# EasyEDA Pro project ProPrj_CH634X-PD-R0-1v1_2025-08-08(1).epro, board PCB6
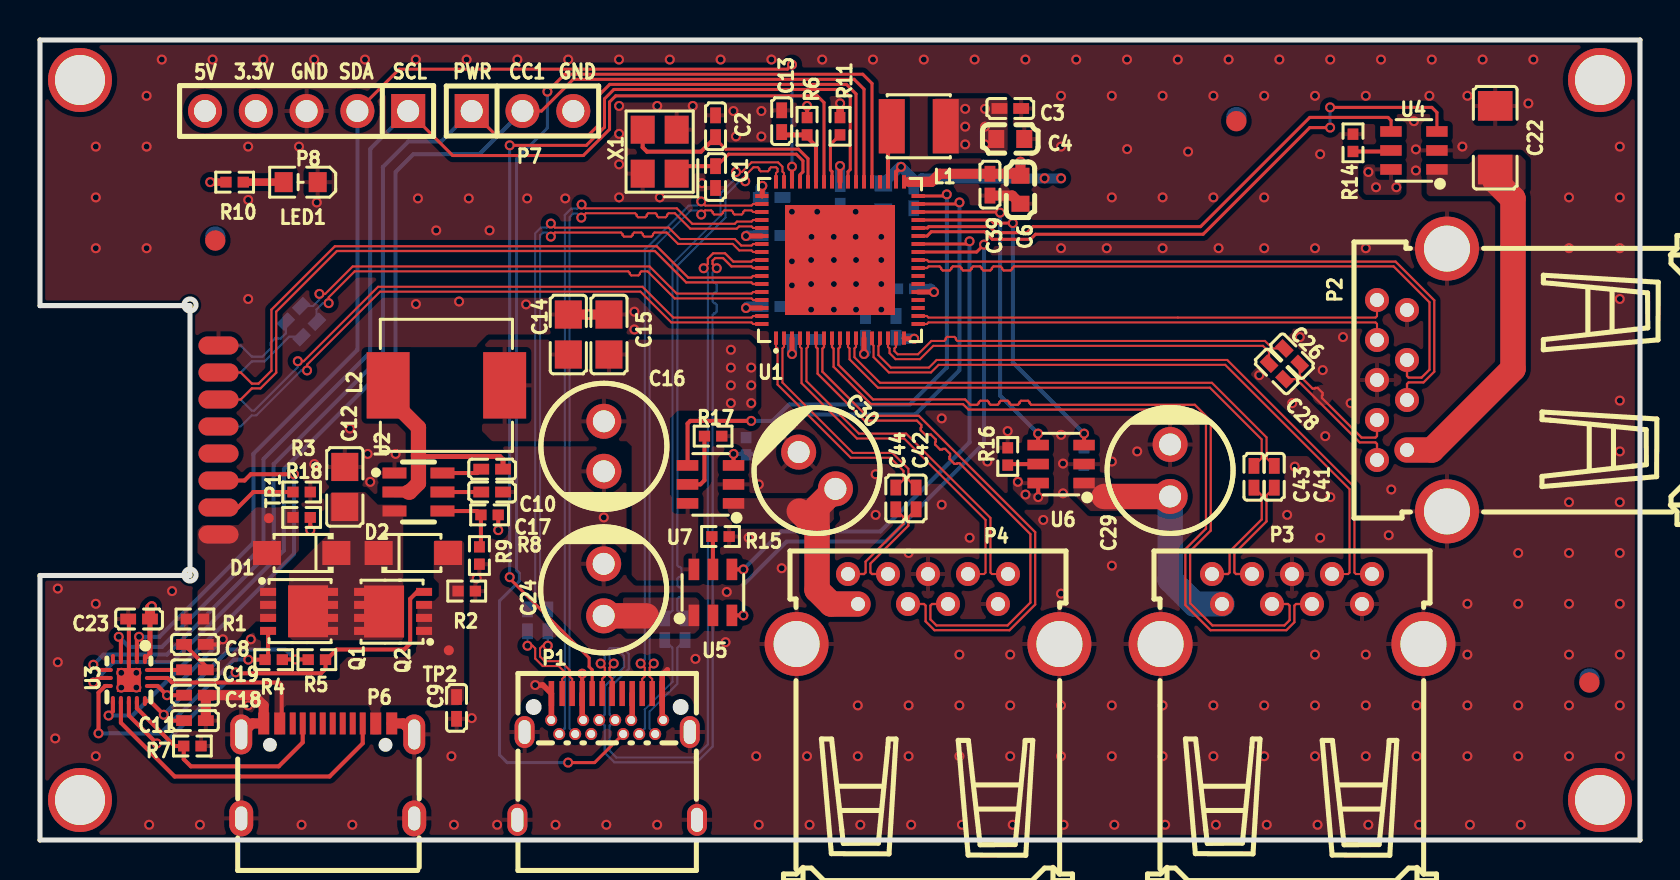
[diagram p1: board, top side]
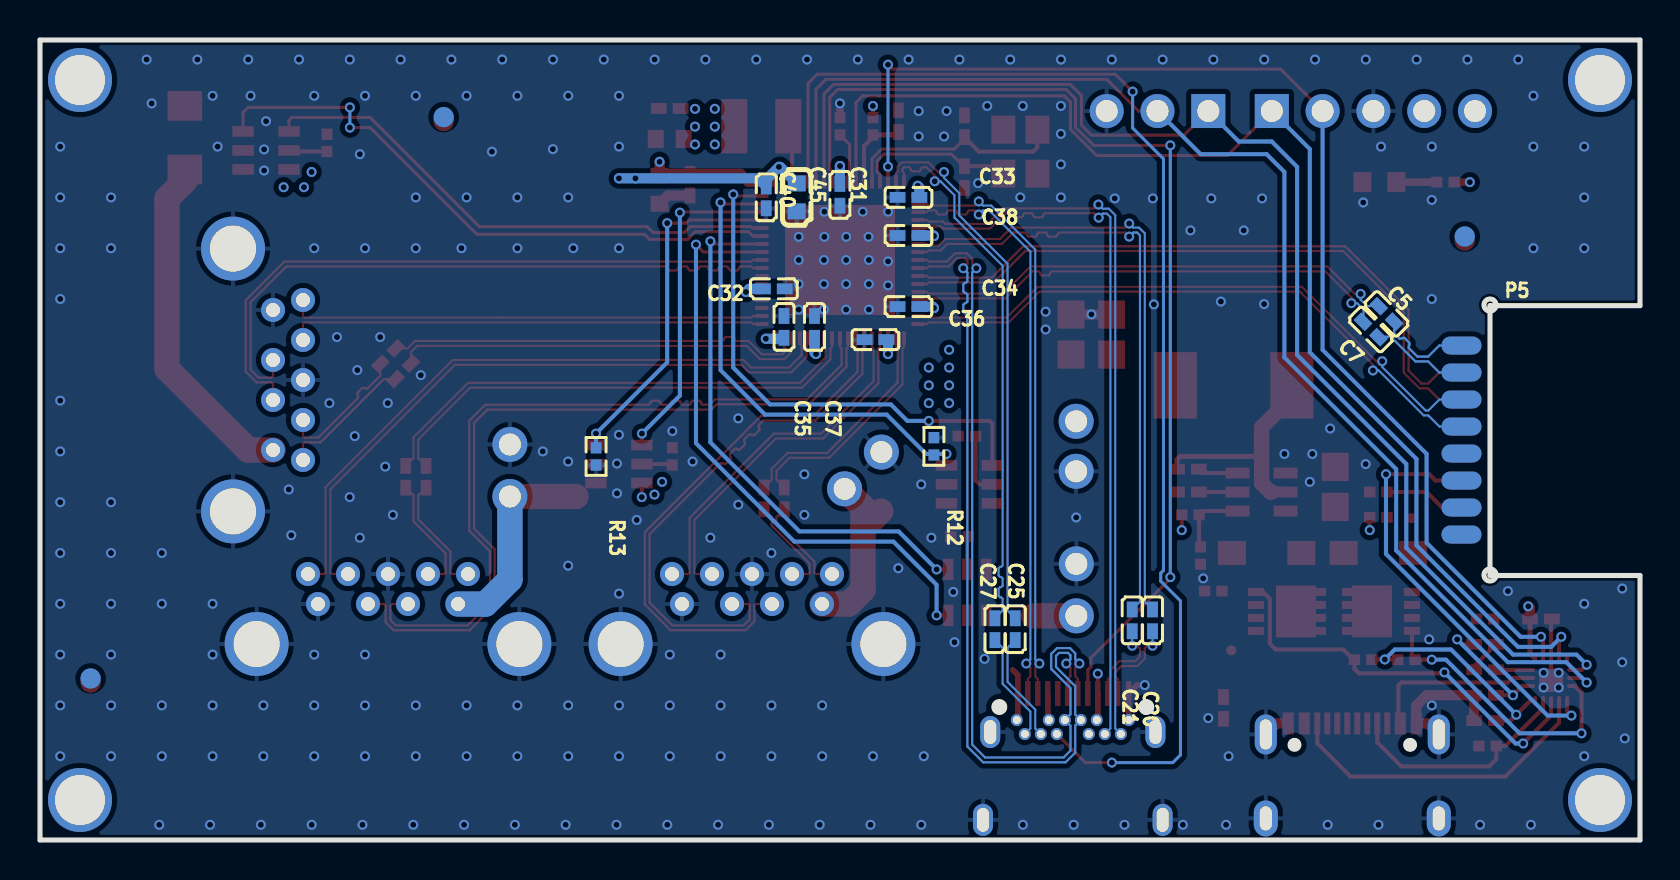
[diagram p2: board, bottom side, seen from below]

Outline 80 x 40 mm; copper layers: Top Layer, Layer 1, Layer 2, Bottom Layer. Coordinates in mm from the lower left corner of the outline.
Outline path: circle c7.5,26.75 r0.3 ; circle c7.5,13.25 r0.3 ; 0,40 80,40 80,0 0,0 0,13.22 7.5,13.22 7.5,26.72 0,26.72 0,40
Stack: Top Layer 0.035mm / Dielectric1 1.51mm FR4 er 4.5 / Layer 1 0.035mm / Dielectric2 0.48mm PP er 4.5 / Layer 2 0.035mm / Dielectric3 0.48mm PP er 4.5 / Bottom Layer 0.035mm

## Design rules (mm)
net UP_HS_DP: DP1
net UP_HS_DM: DP1
net UP_SS_RXA: UP_SS_RX
net UP_SS_RXB: UP_SS_RX
net UP_SS_TXA: UP_SS_TX
net UP_SS_TXB: UP_SS_TX
net P4_SS_TXB: P4_SS_TX
net P4_SS_TXA: P4_SS_TX
net P4_HS_DM: P4_HS_D
net P1_HS_DM: P1_HS_D
net P4_HS_DP: P4_HS_D
net P1_HS_DP: P1_HS_D
net P1_SS_TXB: P1_SS_TX
net P4_SS_RXB: P4_SS_RX
net P1_SS_TXA: P1_SS_TX
net P4_SS_RXA: P4_SS_RX
net P1_SS_RXB: P1_SS_RX
net P1_SS_RXA: P1_SS_RX
net P3_HS_DP: P3_HS_D
net P3_HS_DM: P3_HS_D
net P3_SS_TXB: P3_SS_TX
net P3_SS_TXA: P3_SS_TX
net P3_SS_RXB: P3_SS_RX
net P3_SS_RXA: P3_SS_RX
net P2_SS_TXB: P2_SS_TX
net P2_SS_TXA: P2_SS_TX
net P2_HS_DM: P2_HS_D
net P2_SS_RXB: P2_SS_RX
net P2_HS_DP: P2_HS_D
net P2_SS_RXA: P2_SS_RX
net $1N152: UP_HS_D
net $1N151: UP_HS_D
net $1N61: DP5
net $1N60: DP5
net $1N65: DP6
net $1N1819: DP2
net $1N64: DP6
net $1N1820: DP2
net $1N1769: DP4
net $1N1773: DP3
net $1N1770: DP4
net $1N1774: DP3
net P1C_SS_TXB: DP8
net P1C_SS_TXA: DP8
net P1C_SS_RXB: DP7
net P1C_SS_RXA: DP7
template: 自定义配置
spacing copperThickness1oz (default): track to track 0.102, other pairs 0.025 to 0.3
spacing copperThickness2oz: track to track 0.203, other pairs 0.152 to 0.3
track width copperThickness1oz (default): min 0.127, default 0.203, max 2.54
track width copperThickness2oz: min 0.203, default 0.254, max 2.54
differential pair differentialPair (default): width min 0.127, default 0.254, max 2.54; gap min 0.152, default 0.152
differential pair DIFF90: width min 0.112, default 0.112, max 0.112; gap min 0.127, default 0.127
differential pair DIFF100: width min 0.104, default 0.104, max 0.104; gap min 0.14, default 0.14
via viaSize (default): diameter min 0.5, default 0.5, max 10; hole min 0.3, default 0.3, max 6.299
net UP_HS_DP uses DIFF90
net UP_HS_DM uses DIFF90
net UP_SS_RXA uses DIFF100
net UP_SS_RXB uses DIFF100
net UP_SS_TXA uses DIFF100
net UP_SS_TXB uses DIFF100
net P4_SS_TXB uses DIFF100
net P4_SS_TXA uses DIFF100
net P4_HS_DM uses DIFF90
net P1_HS_DM uses DIFF90
net P4_HS_DP uses DIFF90
net P1_HS_DP uses DIFF90
net P1_SS_TXB uses DIFF100
net P4_SS_RXB uses DIFF100
net P1_SS_TXA uses DIFF100
net P4_SS_RXA uses DIFF100
net P1_SS_RXB uses DIFF100
net P1_SS_RXA uses DIFF100
net P3_HS_DP uses DIFF90
net P3_HS_DM uses DIFF90
net P3_SS_TXB uses DIFF100
net P3_SS_TXA uses DIFF100
net P3_SS_RXB uses DIFF100
net P3_SS_RXA uses DIFF100
net P2_SS_TXB uses DIFF100
net P2_SS_TXA uses DIFF100
net P2_HS_DM uses DIFF90
net P2_SS_RXB uses DIFF100
net P2_HS_DP uses DIFF90
net P2_SS_RXA uses DIFF100
net $1N152 uses DIFF90
net $1N151 uses DIFF90
net $1N61 uses DIFF100
net $1N60 uses DIFF100
net $1N65 uses DIFF100
net $1N1819 uses DIFF90
net $1N64 uses DIFF100
net $1N1820 uses DIFF90
net $1N1769 uses DIFF90
net $1N1773 uses DIFF90
net $1N1770 uses DIFF90
net $1N1774 uses DIFF90
net P1C_SS_TXB uses DIFF100
net P1C_SS_TXA uses DIFF100
net P1C_SS_RXB uses DIFF100
net P1C_SS_RXA uses DIFF100
diff pair DP1 uses DIFF90
diff pair UP_SS_RX uses DIFF100
diff pair UP_SS_TX uses DIFF100
diff pair P4_SS_TX uses DIFF100
diff pair P4_HS_D uses DIFF90
diff pair P1_HS_D uses DIFF90
diff pair P1_SS_TX uses DIFF100
diff pair P4_SS_RX uses DIFF100
diff pair P1_SS_RX uses DIFF100
diff pair P3_HS_D uses DIFF90
diff pair P3_SS_TX uses DIFF100
diff pair P3_SS_RX uses DIFF100
diff pair P2_SS_TX uses DIFF100
diff pair P2_HS_D uses DIFF90
diff pair P2_SS_RX uses DIFF100
diff pair UP_HS_D uses DIFF90
diff pair DP5 uses DIFF100
diff pair DP6 uses DIFF100
diff pair DP2 uses DIFF90
diff pair DP4 uses DIFF90
diff pair DP3 uses DIFF90
diff pair DP8 uses DIFF100
diff pair DP7 uses DIFF100
pour e418 uses copperRegion1
pour e672 uses copperRegion1
pour e734 uses copperRegion1
pour e3995 uses copperRegion1
pour e4331 uses copperRegion1
pour e4785 uses copperRegion1
pour e4806 uses copperRegion1
pour e16219 uses copperRegion1
pour e16602 uses copperRegion1

## Placement (name value [footprint] x y rotation side)
C1  20pF  [C0402]  33.78 33.15 270 top
C2  20pF  [C0402]  33.78 35.69 270 top
C3  1uF  [C0402]  48.51 36.58 180 top
C4  10uF  [C0603]  48.51 35.05 0 top
C5  100nF  [C0402]  12.67 26.3 225 bottom
C6  10uF  [C0603]  49.02 32.51 270 top
C7  100nF  [C0402]  13.46 25.53 225 bottom
C8  1uF  [C0402]  7.75 9.78 0 top
C9  1uF  [C0402]  20.83 6.6 90 top
C10  100nF  [C0402]  22.61 18.54 180 top
C11  100nF  [C0402]  7.75 5.97 180 top
C12  22uF  [C0805]  15.24 17.65 270 top
C13  100nF  [C0402]  37.08 35.94 270 top
C14  22uF  [C0805]  26.42 25.27 270 top
C15  22uF  [C0805]  28.45 25.27 270 top
C16  220uF  [CAP-TH_BD6.3-P2.50-D0.6-FD-1]  28.19 19.68 270 top
C17  1uF  [C0402]  22.61 17.4 180 top
C18  1uF  [C0402]  7.75 7.24 0 top
C19  1uF  [C0402]  7.75 8.51 0 top
C20  100nF  [C0402]  24.37 10.98 270 bottom
C21  100nF  [C0402]  25.39 10.98 270 bottom
C22  47uF  [C1206]  72.76 35.11 90 top
C23  1uF  [C0402]  4.95 11.05 180 top
C24  100uF  [CAP-TH_BD6.3-P2.60-D0.6-FD-1]  28.18 12.51 90 top
C25  100nF  [C0402]  31.24 10.54 90 bottom
C26  100nF  [C0402]  62.6 24.19 135 top
C27  100nF  [C0402]  32.25 10.54 90 bottom
C28  100nF  [C0402]  61.84 23.43 135 top
C29  100uF  [CAP-TH_BD6.3-P2.60-D0.6-FD-1]  56.51 18.48 90 top
C30  100uF  [CAP-TH_BD6.3-P2.60-D0.6-FD-1]  38.85 18.48 135 top
C31  100nF  [C0402]  40.01 32.26 90 bottom
C32  100nF  [C0402]  43.31 27.56 0 bottom
C33  100nF  [C0402]  36.58 32.13 180 bottom
C34  100nF  [C0402]  36.58 26.67 180 bottom
C35  100nF  [C0402]  42.8 25.65 270 bottom
C36  100nF  [C0402]  38.23 25.02 180 bottom
C37  100nF  [C0402]  41.27 25.65 270 bottom
C38  100nF  [C0402]  36.58 30.23 180 bottom
C39  1uF  [C0402]  47.5 32.77 270 top
C40  1uF  [C0402]  43.69 32.13 90 bottom
C41  100nF  [C0402]  61.71 18.16 90 top
C42  100nF  [C0402]  43.8 17.08 90 top
C43  100nF  [C0402]  60.7 18.16 90 top
C44  100nF  [C0402]  42.79 17.08 90 top
C45  10uF  [C0603]  42.16 32.13 270 bottom
D1  DSS34  [SOD-123FL_L2.7-W1.8-LS3.8-RD]  13.08 14.35 180 top
D2  DSS34  [SOD-123FL_L2.7-W1.8-LS3.8-RD]  18.67 14.35 0 top
L1  2.2uH  [IND-SMD_L3.0-W3.0_FNR30XXS]  43.94 35.69 180 top
L2  15uH  [IND-SMD_L7.1-W6.6]  20.32 22.73 0 top
LED1  A-SP192DGHC-C01-4T  [LED0603-FD]  13.03 32.89 0 top
NOREF  -  [Pad_e341]  78 38 0 top
NOREF#2  -  [Pad_e12903]  59.82 36.14 0 top
NOREF#3  -  [Pad_e12655]  8.76 29.97 0 top
NOREF#4  -  [Pad_e342]  78 2 0 top
NOREF#5  -  [Pad_e12905]  77.47 8.08 0 top
NOREF#6  -  [Pad_e12902]  8.76 30.18 0 top
NOREF#7  -  [Pad_e340]  2 38 0 top
NOREF#8  -  [Pad_e338]  2 2 0 top
NOREF#9  -  [Pad_e12906]  77.47 7.87 0 top
NOREF#10  -  [Pad_e12904]  59.82 35.94 0 top
P1  TYPEC-324-BCP24  [TYPE-C-SMD_TYPE-C-24P-QCHT]  28.36 4.17 0 top
P2  UEA1112C-4HK1-4H  [USB-TH_XUNPU_USB-301WD-ARY]  68.6 23 90 top
P3  UEA1112C-4HK1-4H  [USB-TH_XUNPU_USB-301WD-ARY]  62.6 11.55 0 top
P4  UEA1112C-4HK1-4H  [USB-TH_XUNPU_USB-301WD-ARY]  44.4 11.55 0 top
P5  PC  [CABLE-TYPEC1]  8.92 20 180 bottom
P6  TYPE-C 16PIN 2MD(073)  [USB-C-SMD_TYPE-C-6PIN-2MD-073]  14.39 3.45 0 top
P7  PZ254V-11-03P  [HDR-TH_3P-P2.54-V-M]  24.13 36.45 0 top
P8  PZ254V-11-05P  [HDR-TH_5P-P2.54-V-M]  13.33 36.45 180 top
Q1  SE3080G  [DFN-8_L3.1-W3.0-P0.65-LS3.3-BL]  12.95 11.43 270 top
Q2  SE3080G  [DFN-8_L3.1-W3.0-P0.65-LS3.3-BL]  17.65 11.43 90 top
R1  10kΩ  [R0402]  7.75 11.05 180 top
R2  10kΩ  [R0402]  21.34 12.45 0 top
R3  1kΩ  [R0402]  13.08 17.4 0 top
R4  680kΩ  [R0402]  11.68 9.02 0 top
R5  680kΩ  [R0402]  13.84 9.02 180 top
R6  0Ω  [R0402]  38.35 35.69 90 top
R7  5.1kΩ  [R0402]  7.62 4.7 0 top
R8  105kΩ  [R0402]  22.48 16.26 0 top
R9  20kΩ  [R0402]  21.97 14.22 90 top
R10  2kΩ  [R0402]  9.73 32.89 180 top
R11  10kΩ  [R0402]  40 35.69 90 top
R12  10kΩ  [R0402]  35.31 19.68 90 bottom
R13  10kΩ  [R0402]  52.2 19.18 270 bottom
R14  24kΩ  [R0402]  65.65 34.86 90 top
R15  24kΩ  [R0402]  34.03 15.17 0 top
R16  24kΩ  [R0402]  48.39 19.18 90 top
R17  24kΩ  [R0402]  33.65 20.19 0 top
R18  0Ω  [R0402]  13.08 16.13 0 top
TP1  -  [Test-Point-0.5mm]  11.44 16.09 0 top
TP2  -  [Test-Point-0.5mm]  20.44 9.48 0 top
U1  CH634X  [QFN-68_L8.0-W8.0-P0.40-TL-EP5.5]  40 29 90 top
U2  ETA2807FT2G  [TSOT-23-6_L2.9-W1.6-P0.95-LS2.8-BL]  18.92 17.4 270 top
U3  CH211C  [QFN16C_2X2]  4.45 8 180 top
U4  CH217K  [SOT-23-6_L2.9-W1.6-P0.95-LS2.8-BL]  68.7 34.48 90 top
U5  CH217K  [SOT-23-6_L2.9-W1.6-P0.95-LS2.8-BL]  33.64 12.38 0 top
U6  CH217K  [SOT-23-6_L2.9-W1.6-P0.95-LS2.8-BL]  51.05 18.8 90 top
U7  CH217K  [SOT-23-6_L2.9-W1.6-P0.95-LS2.8-BL]  33.53 17.78 90 top
X1  24MHz  [CRYSTAL-SMD_4P-L3.2-W2.5-BL]  30.98 34.42 90 top

## Footprints (pads in the part's own frame, mm; a bottom-side part is the same pattern mirrored in y, then rotated)
C0402
  rect 0.79x0.54 smd: 1(-0.545,0) 2(0.545,0)
C0603
  rect 0.8x0.9 smd: 1(-0.7,0) 2(0.7,0)
C0805
  rect 1.41x1.35 smd: 1(-1,0) 2(1,0)
C1206
  rect 1.485x1.728 smd: 1(-1.593,0) 2(1.593,0)
CABLE-TYPEC1
  oval 2x0.9 smd: 1(0,-4.725) 2(0,-3.375) 3(0,-2.025) 4(0,-0.675) 5(0,0.675) 6(0,2.025) 7(0,3.375) 8(0,4.725)
  oval 2x0.9 smd far side: 9(0,-4.725) 10(0,-3.375) 11(0,-2.025) 12(0,-0.675) 13(0,0.675) 14(0,2.025) 15(0,3.375) 16(0,4.725)
CAP-TH_BD6.3-P2.50-D0.6-FD-1
  round 1.75 hole 1.1: 1(-1.25,0) 2(1.25,0)
CAP-TH_BD6.3-P2.60-D0.6-FD-1
  round 1.75 hole 1.1: 1(-1.3,0) 2(1.3,0)
CRYSTAL-SMD_4P-L3.2-W2.5-BL
  rect 1.4x1.2 smd: 1(-1.1,-0.85) 2(1.1,-0.85) 3(1.1,0.85) 4(-1.1,0.85)
DFN-8_L3.1-W3.0-P0.65-LS3.3-BL
  rect 0.4x0.8 smd: 1(-0.975,-1.55) 2(-0.325,-1.55) 3(0.326,-1.55) 4(0.975,-1.55) 5(0.975,1.55) 6(0.325,1.55) 7(-0.325,1.55) 8(-0.975,1.55)
  rect 2.6x2 smd: 8(-0.004,0.45)
HDR-TH_3P-P2.54-V-M
  rect 1.7x1.7 hole 1.1: 1(-2.54,0)
  round 1.7 hole 1.1: 2(0,0) 3(2.54,0)
HDR-TH_5P-P2.54-V-M
  rect 1.7x1.7 hole 1.1: 1(-5.08,0)
  round 1.7 hole 1.1: 2(-2.54,0) 3(0,0) 4(2.54,0) 5(5.08,0)
IND-SMD_L3.0-W3.0_FNR30XXS
  rect 1.3x2.72 smd: 1(1.35,0) 2(-1.35,0)
IND-SMD_L7.1-W6.6
  rect 2.15x3.32 smd: 1(-2.913,0) 2(2.913,0)
LED0603-FD
  rect 0.9x1 smd: 1(-0.85,0) 2(0.85,0)
Pad_e338
  round 3.2 hole 2.5: 1(0,0)
Pad_e340
  round 3.2 hole 2.5: 1(0,0)
Pad_e341
  round 3.2 hole 2.5: 1(0,0)
Pad_e342
  round 3.2 hole 2.5: 1(0,0)
Pad_e12655
  round 1.016 smd: 1(0,0)
Pad_e12902
  round 1.016 smd far side: 1(0,0)
Pad_e12903
  round 1.016 smd far side: 1(0,0)
Pad_e12904
  round 1.016 smd: 1(0,0)
Pad_e12905
  round 1.016 smd far side: 1(0,0)
Pad_e12906
  round 1.016 smd: 1(0,0)
QFN16C_2X2
  rect 1.2x1.2 smd: 0(0,0)
  oval 0.2x0.5 smd: 1(-0.8,-1.05) 2(-0.4,-1.05) 4(0.4,-1.05) 5(0.8,-1.05) 9(0.8,1.05) 10(0.4,1.05) 11(0,1.05) 12(-0.4,1.05) 13(-0.8,1.05)
  oval 0.2x1 smd: 3(0,-0.8)
  oval 0.5x0.2 smd: 6(1.05,-0.5) 7(1.05,-0.1) 8(1.05,0.3) 14(-1.05,0.3) 15(-1.05,-0.1) 16(-1.05,-0.5)
QFN-68_L8.0-W8.0-P0.40-TL-EP5.5
  rect 0.665x0.2 smd: 1(-3.908,3.2) 2(-3.908,2.8) 3(-3.908,2.4) 4(-3.908,2) 5(-3.908,1.6) 6(-3.908,1.2) 7(-3.908,0.8) 8(-3.908,0.4) 9(-3.908,0) 10(-3.908,-0.4) 11(-3.908,-0.8) 12(-3.908,-1.2) 13(-3.908,-1.6) 14(-3.908,-2) 15(-3.908,-2.4) 16(-3.908,-2.8) 17(-3.908,-3.2) 35(3.908,-3.2) 36(3.908,-2.8) 37(3.908,-2.4) 38(3.908,-2) 39(3.908,-1.6) 40(3.908,-1.2) 41(3.908,-0.8) 42(3.908,-0.4) 43(3.908,0) 44(3.908,0.4) 45(3.908,0.8) 46(3.908,1.2) 47(3.908,1.6) 48(3.908,2) 49(3.908,2.4) 50(3.908,2.8) 51(3.908,3.2)
  rect 0.2x0.665 smd: 18(-3.2,-3.908) 19(-2.8,-3.908) 20(-2.4,-3.908) 21(-2,-3.908) 22(-1.6,-3.908) 23(-1.2,-3.908) 24(-0.8,-3.908) 25(-0.4,-3.908) 26(0,-3.908) 27(0.4,-3.908) 28(0.8,-3.908) 29(1.2,-3.908) 30(1.6,-3.908) 31(2,-3.908) 32(2.4,-3.908) 33(2.8,-3.908) 34(3.2,-3.908) 52(3.2,3.908) 53(2.8,3.908) 54(2.4,3.908) 55(2,3.908) 56(1.6,3.908) 57(1.2,3.908) 58(0.8,3.908) 59(0.4,3.908) 60(0,3.908) 61(-0.4,3.908) 62(-0.8,3.908) 63(-1.2,3.908) 64(-1.6,3.908) 65(-2,3.908) 66(-2.4,3.908) 67(-2.8,3.908) 68(-3.2,3.908)
  rect 5.5x5.5 smd: 69(0,0)
R0402
  rect 0.566x0.54 smd: 1(-0.433,0) 2(0.433,0)
SOD-123FL_L2.7-W1.8-LS3.8-RD
  rect 1.4x1.2 smd: 1(-1.735,0) 2(1.735,0)
SOT-23-6_L2.9-W1.6-P0.95-LS2.8-BL
  rect 0.532x1.072 smd: 1(-0.95,-1.149) 2(0,-1.149) 3(0.95,-1.149) 4(0.95,1.149) 5(0,1.149) 6(-0.95,1.149)
Test-Point-0.5mm
  round 0.5 smd: 1(0,0)
TSOT-23-6_L2.9-W1.6-P0.95-LS2.8-BL
  rect 0.55x1.2 smd: 1(-0.95,-1.2) 2(0,-1.2) 3(0.95,-1.2) 4(0.95,1.2) 5(0,1.2) 6(-0.95,1.2)
TYPE-C-SMD_TYPE-C-24P-QCHT
  oval 1x1.6 hole 0.6x1.2: 25(-4.49,-3.158) 25(-4.13,1.232) 25(4.13,1.232) 25(4.49,-3.158)
  rect 0.275x1.25 smd: A1(-2.79,3.158) A2(-2.25,3.158) A3(-1.75,3.158) A4(-1.25,3.158) A5(-0.75,3.158) A6(-0.25,3.158) A7(0.25,3.158) A8(0.75,3.158) A9(1.25,3.158) A10(1.75,3.158) A11(2.25,3.158) A12(2.75,3.158)
  round 0.6 hole 0.4: B1(2.8,1.833) B2(2.4,1.133) B3(1.601,1.133) B4(1.2,1.833) B5(0.8,1.133) B6(0.4,1.833) B7(-0.4,1.833) B8(-0.8,1.133) B9(-1.2,1.833) B10(-1.6,1.133) B11(-2.4,1.133) B12(-2.8,1.833)
USB-C-SMD_TYPE-C-6PIN-2MD-073
  rect 0.55x1.1 smd: 1(-3.2,2.375) 2(-2.4,2.375) 11(2.4,2.375) 12(3.2,2.375)
  rect 0.3x1.1 smd: 3(-1.75,2.375) 4(-1.25,2.375) 5(-0.75,2.375) 6(-0.25,2.375) 7(0.25,2.375) 8(0.75,2.375) 9(1.25,2.375) 10(1.75,2.375)
  oval 1.1x2 hole 0.6x1.5: 13(-4.325,1.825) 14(4.325,1.825)
  oval 1.2x1.8 hole 0.6x1.2: 13(-4.325,-2.375) 14(4.325,-2.375)
USB-TH_XUNPU_USB-301WD-ARY
  round 1.2 hole 0.7: 1(-3.5,0.25) 2(-1,0.25) 3(1,0.25) 4(3.5,0.25) 5(4,1.75) 6(2,1.75) 7(0,1.75) 8(-2,1.75) 9(-4,1.75)
  round 3.2 hole 2.3: 10(-6.57,-1.75) 10(6.57,-1.75)

## Nets
As in the schematic, except:
VBUS: C8.2 C18.1 D1.2 P5.9 Q1.1 Q1.2 Q1.3 R1.1 R18.1 TP1.1 U3.14
VIN: C9.2 D2.2 P6.2 P6.11 Q2.1 Q2.2 Q2.3 R2.1 TP2.1 U3.15
VHV: C12.2 D1.1 D2.1 Q1.5 Q1.6 Q1.7 Q1.8 Q2.5 Q2.6 Q2.7 Q2.8 U2.3

Pads without a net: NOREF 1; NOREF#2 1; NOREF#3 1; NOREF#4 1; NOREF#5 1; NOREF#6 1; NOREF#7 1; NOREF#8 1; NOREF#9 1; NOREF#10 1; P1 A8 B8; P5 1 2 3 4 12 13; P6 3 5 6 7 8 9; U1 20 21 23 24 38; U3 5

## Via types
v1: diameter 0.5, hole 0.299, Top Layer to Bottom Layer, 286 vias
v2: diameter 0.5, hole 0.3, Top Layer to Bottom Layer, 59 vias

## Routing (per net, layer and track width the routed paths; a pad name or vN(x,y) marks a point on that pad's centre or on a via; arc(x,y) is an arc through that point)
DVDD12: length 12.2
  Top Layer w0.254: U1.52 36.11,32.22 v2(36.11,32.71) ; U1.12 v2(41.2,24.3) ; U1.57 v2(35.3,30.2) ; U1.66 v2(35.3,26.6) ; v2(43.71,25.06) 43.23,25.06 U1.17 ; U1.22 v2(44.7,27.4) ; U1.43 v2(40,33.7) ; U1.3 v2(37.6,24.3)
  Bottom Layer w0.508: v2(43.71,25.06) 42.85,25.06 C35.2 ; C38.2 35.33,30.23 v2(35.3,30.2) ; C32.2 44.54,27.56 v2(44.7,27.4) ; v2(37.6,24.3) 37.6,24.94 C36.2 ; v2(35.3,26.6) 35.37,26.67 C34.2 ; C33.2 36.03,32.62 v2(36.11,32.71) ; v2(40,33.7) 40.01,33.69 C31.2 ; v2(41.2,24.3) 41.27,24.38 C37.2
  vias: v1(46.26,36.56) v1(46.26,35.67) v1(46.26,34.78) v1(47.25,36.56) v1(47.25,35.67) v1(47.25,34.78)
GND: length 21.4
  Top Layer w0.203: C8.1 8.29,8.69 C19.2 ; U3.3 4.45,11.01 C23.2
  Top Layer w0.28: P1.B1 31.11,6.05 P1.A12 31.11,8.25 31.37,8.51 ; 25.56,6 25.57,6.01 P1.A1 25.15,7.75 v1(24.76,7.75)
  Top Layer w0.381: v2(40.01,36.83) 40.01,36.12 R11.2
  Top Layer w0.508: P6.12 18.16,5.83 P6.14 ; C6.2 48.61,32.22 C39.2 ; C15.1 27.44,26.27 v1(27.43,26.28) 27.42,26.27 C14.1 ; P6.13 10.61,5.83 P6.1 11.19,6.72 10.67,7.24 C18.2 C11.1
  vias: v1(0.76,5.08) v1(0.89,12.57) v1(0.89,8.89) v1(2.79,34.67) v1(2.79,32.13) v1(2.79,29.59) v1(2.79,11.81) v1(2.79,4.19) v1(5.33,37.21) v1(5.33,34.67) v1(5.33,29.59) v1(5.46,0.76) v1(6.09,39.02) v1(6.6,12.45) v1(8,0.76) v1(8.63,39.02) v1(10.41,34.67) v1(10.41,32) v1(10.41,27.05) v1(10.41,6.73) v1(11.17,39.02) v1(12.95,34.67) v1(13.08,0.76) v1(13.71,39.02) v1(13.72,18.8) v1(13.84,31.88) v1(15.49,20.57) v1(15.62,0.76) v1(16.25,39.02) v1(16.38,19.3) v1(16.51,17.91) v1(17.78,19.3) v1(18.79,39.02) v1(18.8,26.8) v1(18.9,32.08) v1(19.81,30.48) v1(20.57,4.19) v1(20.7,0.76) v1(20.95,26.92) v1(21.33,39.02) v1(21.44,32.08) v1(21.59,6.09) v1(21.84,13.08) v1(22.48,30.48) v1(22.86,0.76) v1(23.87,39.02) v1(24.36,32.08) v1(24.31,26.78) v1(25.78,0.76) v1(26.26,32.08) v1(26.41,39.02) v1(28.19,16.13) v1(28.32,0.76) v1(28.95,39.02) v1(29.72,26.42) v1(29.72,25.53) v1(30.86,0.76) v1(30.99,32.13) v1(31.49,39.02) v1(32.77,9.06) v1(34.03,39.02) v1(34.28,9.89) v1(34.34,12.4) v1(35.43,15.11) v1(35.81,4.19) v1(35.94,17.78) v1(35.94,0.76) v1(36.57,39.02) v1(37.08,13.59) v1(38.35,4.19) v1(38.48,0.76) v1(39.11,39.02) v1(40.89,6.73) v1(40.89,4.19) v1(41.02,0.76) v1(41.65,39.02) v1(41.78,18.29) v1(41.78,16.26) v1(43.43,14.35) v1(43.43,6.73) v1(43.43,4.19) v1(43.56,0.76) v1(44.19,39.02) v1(45.08,21.08) v1(45.08,16.76) v1(45.97,9.27) v1(45.97,6.73) v1(45.97,4.19) v1(46.1,0.76) v1(46.48,15.11) v1(46.73,39.02) v1(47.37,18.92) v1(48.38,20.45) v1(48.51,9.27) v1(48.51,6.73) v1(48.51,4.19) v1(48.64,0.76) v1(49.27,39.02) v1(50.17,16) v1(51.05,37.21) v1(51.05,34.67) v1(51.05,29.59) v1(51.05,20.26) v1(51.05,12.32) v1(51.05,6.73) v1(51.05,4.19) v1(51.15,18.82) v1(51.15,17.33) v1(51.18,0.76) v1(51.81,39.02) v1(53.34,29.59) v1(53.59,37.21) v1(53.59,32.13) v1(53.59,6.73) v1(53.59,4.19) v1(53.59,18.92) v1(53.59,13.72) v1(53.72,0.76) v1(54.35,39.02) v1(54.36,34.54) v1(54.86,19.43) v1(56.13,37.21) v1(56.13,32.13) v1(56.13,29.59) v1(56.13,6.73) v1(56.13,4.19) v1(56.26,0.76) v1(56.89,39.02) v1(57.4,34.42) v1(58.67,37.21) v1(58.67,32.13) v1(58.67,6.73) v1(58.67,4.19) v1(58.8,0.76) v1(58.93,29.59) v1(59.43,39.02) v1(60.96,23.24) v1(61.21,37.21) v1(61.21,32.13) v1(61.21,29.59) v1(61.21,6.73) v1(61.21,4.19) v1(61.34,0.76) v1(61.97,39.02) v1(62.36,16.26) v1(62.61,21.84) v1(62.74,18.67) v1(62.99,25.15) v1(63.75,37.21) v1(63.75,29.59) v1(63.75,9.27) v1(63.75,6.73) v1(63.75,4.19) v1(63.88,0.76) v1(64.01,34.29) v1(64.01,15.11) v1(64.14,23.49) v1(64.26,20.19) v1(64.51,39.02) v1(64.52,17.14) v1(65.15,25.15) v1(65.53,21.84) v1(66.29,37.21) v1(66.29,29.59) v1(66.29,9.27) v1(66.29,6.73) v1(66.29,4.19) v1(66.42,0.76) v1(67.05,39.02) v1(67.44,15.24) v1(67.56,17.53) v1(68.7,35.94) v1(68.79,34.53) v1(68.79,33.48) v1(68.83,6.73) v1(68.83,4.19) v1(68.96,0.76) v1(69.47,37.21) v1(69.59,39.02) v1(71.12,34.67) v1(71.37,37.21) v1(71.37,11.81) v1(71.37,9.27) v1(71.37,6.73) v1(71.37,4.19) v1(71.5,0.76) v1(72.13,39.02) v1(73.91,14.35) v1(73.91,11.81) v1(73.91,6.73) v1(73.91,4.19) v1(74.04,0.76) v1(74.42,36.83) v1(74.67,39.02) v1(76.45,32.13) v1(76.45,29.59) v1(76.45,16.89) v1(76.45,14.35) v1(76.45,11.81) v1(76.45,9.27) v1(76.45,6.73) v1(76.45,4.19) v1(78.99,34.67) v1(78.99,32.13) v1(78.99,29.59) v1(78.99,27.05) v1(78.99,21.97) v1(78.99,19.43) v1(78.99,16.89) v1(78.99,14.35) v1(78.99,11.81) v1(78.99,9.27) v1(78.99,6.73) v1(78.99,4.19) v2(4.06,8.36) v2(4.06,7.62) v2(4.82,8.36) v2(4.82,7.62) v2(10.54,10.03) v2(28.96,36.7) v2(28.96,35.31) v2(28.96,33.78) v2(28.96,32.13) v2(30.86,36.7) v2(32.64,36.7) v2(33.1,32.84) v2(34.67,36.45) v2(34.8,35.18) v2(36.07,36.45) v2(36.07,35.18) v2(37.6,31.41) v2(37.6,28.93) v2(37.6,27.73) v2(38.58,30.16) v2(38.56,29) v2(38.56,27.8) v2(38.56,26.52) v2(38.86,31.41) v2(39.69,30.16) v2(39.7,29) v2(39.7,27.8) v2(39.7,26.52) v2(40.78,31.41) v2(40.78,30.16) v2(40.8,29) v2(40.8,27.8) v2(40.8,26.52) v2(42.06,30.16) v2(42.06,29) v2(42.06,27.8) v2(42.06,26.52)
VBUS: length 6.8
  Top Layer w0.203: C8.2 8.89,9.78 v2(9.14,10.03) ; U3.14 5.89,7.7 v2(6.35,7.24) C18.1
  Bottom Layer w0.203: v2(6.35,7.24) v2(9.14,10.03)
VBUS_EN: length 14.1
  Top Layer w0.203: U3.8 3.26,7.7 2.93,7.37 v2(2.93,5.33) ; v2(10.41,9.02) 11.38,9.02 11.4,8.99 Q1.4
  Bottom Layer w0.203: v2(10.41,9.02) 9.7,9.02 6.02,5.33 v2(2.93,5.33)
VBUS_OUT1: length 17.2
  Top Layer w0.203: P1.A4 v1(27.11,8.32)
  Top Layer w0.28: P1.B9 27.11,6.05 P1.A4 ; 29.56,6 29.61,6.05 P1.A9
  Top Layer w1.27: C24.1 30.32,11.21
  Layer 2 w0.508: 29.56,6 29.56,8.08 29.34,8.3 29.34,10.05 C24.1 27.16,10.18 P1.B9
VBUS_OUT2: length 17.3
  Top Layer w1.27: P2.1 69.59,19.5 73.65,23.56 73.65,32.06 72.76,32.95 C22.1
VBUS_OUT3: length 10.6
  Top Layer w1.27: C29.1 53.2,17.18
  Bottom Layer w1.27: P3.1 57.72,11.8 56.51,13.02 C29.1
VBUS_OUT4: length 9
  Top Layer w1.27: 38.85,15.55 38.85,16.64 39.77,17.56 ; 38.85,15.55 38.85,12.51 39.56,11.8 P4.1 ; 38.85,15.55 37.96,16.44
VDD5: length 16.3
  Top Layer w0.203: v1(43.05,33.66) 42.8,33.4 U1.36 ; v1(49.91,17.14) 49.91,17.84 U6.6 ; R8.2 v1(22.91,15.49) ; R18.2 v1(13.51,15.49)
  Top Layer w0.381: R10.2 v1(8.51,32.89)
  Layer 2 w1.27: P8.5 8.25,33.91
  Bottom Layer w0.508: v1(51.05,33.08) v1(50.23,33.08) 44.1,33.08 C40.2 43.69,33.02 v1(43.05,33.66) 42.99,33.66 42.16,32.83
  vias: v1(34.54,24.51) v1(34.54,23.62) v1(34.54,22.73) v1(34.54,21.84) v1(35.56,23.62) v1(35.56,22.73) v1(35.56,21.84) v1(48.89,17.91) v1(49.28,17.27) v1(66.42,33.4) v1(66.8,32.64) v1(67.82,32.64)
VDD33: length 102.2
  Top Layer w0.203: 5.5,9.3 U3.1 ; U1.35 43.43,32.91 ; R6.2 v1(38.35,36.7)
  Top Layer w0.254: C23.1 5.5,9.3
  Top Layer w0.508: v1(5.59,11.68) 5.5,11.59 C23.1 ; v1(49.02,33.91) C6.1 48.92,33.31 C39.1 44.98,33.31 44.58,32.91 43.43,32.91
  Layer 2 w0.508: v1(49.02,33.91) 49.02,37.34 48.51,37.85 38.35,37.85 ; P8.4 10.79,37.85 ; 10.79,37.85 11.11,38.16 32.23,38.16 32.55,37.85 38.35,37.85 ; 10.79,37.85 6.98,37.85 6.6,37.46 6.6,29.97 7.24,29.34 16.13,29.34 16.64,28.83 16.64,20.57 12.57,16.51 12.57,12.83 11.43,11.68 v1(5.59,11.68) ; 38.35,37.85 v1(38.35,36.7)
VIN: length 8.7
  Top Layer w0.203: P6.2 12.08,5.92 12.08,7.73 11.94,7.87 6.6,7.87 6.38,8.1 5.5,8.1
VIN_EN: length 20.8
  Top Layer w0.203: v2(5.84,4.83) 4.45,6.22 U3.11 ; 19.2,12.41 18.86,12.41 18.51,12.06 18.51,9.82 18.21,9.52 14.83,9.52 14.33,9.02 R5.1 14.28,8.56 14.05,8.33 9.83,8.33 v2(9.78,8.38)
  Bottom Layer w0.203: v2(5.84,4.83) 6.22,4.83 v2(9.78,8.38)
CC1_P1: length 11.7
  Top Layer w0.203: 4.84,6.95 4.84,6.58 6.73,4.7 R7.1 7.19,4.04 7.54,3.68 11.94,3.68 13.14,4.88 P6.4
CC1_P2: length 21.3
  Top Layer w0.203: v1(12.7,18.29) 10.54,18.29 10.23,17.97 P5.11 ; 3.64,6.95 3.64,6.44 v2(3.43,6.22)
  Bottom Layer w0.203: v1(12.7,18.29) 12.7,14.3 4.62,6.22 v2(3.43,6.22)
CC2_P1: length 16
  Top Layer w0.203: P6.10 16.14,4.83 14.48,3.17 6.73,3.17 4.05,5.86 U3.10
HVCP: length 11.8
  Top Layer w0.203: C11.2 6.48,5.97 v2(6.19,6.26) 5.5,6.95 U3.13 ; R5.2 13.4,9.03 v2(12.76,9.03) 12.11,9.03
  Bottom Layer w0.203: v2(6.19,6.26) 9.45,9.52 12.26,9.52 v2(12.76,9.03)
OVCUR1#: length 30.4
  Top Layer w0.152: v1(47.2,29.77) 46.83,29.4 U1.27
  Top Layer w0.203: 34.6,11.23 v1(35.17,11.23)
  Bottom Layer w0.203: v1(47.2,29.77) 47.2,19.84 42.28,14.92 37.33,14.92 35.17,12.76 v1(35.17,11.23)
OVCUR2#: length 30.6
  Top Layer w0.152: v1(64.51,35.62) 63.49,35.62 58.16,30.29 49.77,30.29 49.52,30.03 47.61,30.03 47.23,30.41 44.57,30.41 44.35,30.2 U1.29 ; U4.3 69.85,36.38 69.59,36.63 v1(64.51,36.63)
  Bottom Layer w0.152: v1(64.51,36.63) v1(64.51,35.62)
OVCUR3#/GANG_EN#: length 18.1
  Top Layer w0.152: v1(48.64,30.84) 47.69,30.84 47.54,31 U1.31
  Top Layer w0.203: U6.3 v1(52.2,20.32)
  Bottom Layer w0.203: v1(48.64,30.84) 48.64,23.88 v1(52.2,20.32) 52.2,20.31 R13.1
OVCUR4#/GANG_EN#: length 24.1
  Top Layer w0.152: U1.33 45.9,31.8 v1(45.97,31.88)
  Top Layer w0.203: U7.3 v1(34.68,19.3)
  Bottom Layer w0.203: v1(34.68,19.3) 35.7,19.3 37.67,21.27 43.75,21.27 45.97,23.49 v1(45.97,31.88)
P1_CC1: length 52.6
  Top Layer w0.152: P1.A5 27.61,8.51 27.46,8.66 27.46,9.1 23.48,13.08 v1(23.48,13.14) ; v1(23.48,34.73) 27.32,34.73 28.22,35.64 28.22,37.06 28.69,37.53 40.12,37.53 40.51,37.13 40.51,33.53 40.4,33.41 U1.42
  Bottom Layer w0.152: v1(23.48,34.73) v1(23.48,13.14)
P1_CC2/PWR_CC: length 65.4
  Top Layer w0.152: U1.41 40.8,37.3 40.33,37.78 28.48,37.78 27.93,37.23 27.93,35.75 27.42,35.24 22.79,35.24 21.58,36.45
  Top Layer w0.203: v2(2.67,8.76) 2.93,8.5 U3.6
  Bottom Layer w0.203: 21.58,36.45 20.06,34.92 18.42,34.92 17.14,33.66 17.14,24.26 11.68,18.8 11.68,14.6 6.35,9.27 3.17,9.27 v2(2.67,8.76)
P1_HS_DM: length 42
  Top Layer w0.112: v1(33.84,28.59) 33.63,28.8 33.63,28.97 33.76,29.1 34.15,29.1 34.57,28.68 35.57,28.68 35.65,28.6 U1.61 ; P1.A7 28.61,8.06 28.48,8.19 28.48,8.62 v1(28.69,8.82)
  Bottom Layer w0.112: v1(33.84,28.59) 33.63,28.38 33.63,27.94 33.71,27.86 33.75,27.86 33.83,27.78 33.83,27.43 33.75,27.35 33.71,27.35 33.63,27.27 33.63,26.92 33.71,26.84 33.75,26.84 33.83,26.77 33.83,26.42 33.75,26.34 33.71,26.34 33.63,26.26 33.63,4.67 32.84,3.89 28.72,3.89 28.24,4.37 28.24,5.72 P1.B7 28.24,6.28 28.24,7.69 29.2,8.65 29.2,9.2 29.05,9.36 28.6,9.36 28.48,9.24 28.48,9.03 v1(28.69,8.82)
P1_HS_DP: length 41.9
  Top Layer w0.112: U1.60 35.65,29 35.57,28.92 34.67,28.92 34.25,29.33 33.66,29.33 33.39,29.07 33.39,28.8 v1(33.18,28.59) ; P1.A6 28.11,8.06 28.24,8.19 28.24,8.62 v1(28.03,8.82)
  Bottom Layer w0.112: v1(33.18,28.59) 33.39,28.38 33.39,4.77 32.74,4.12 28.82,4.12 28.48,4.47 28.48,5.72 P1.B6 28.48,6.28 28.48,7.59 29.44,8.55 29.44,9.3 29.15,9.59 28.5,9.59 28.24,9.34 28.24,9.03 v1(28.03,8.82)
P1_SS_RXA: length 36.6
  Top Layer w0.104: v1(27.08,31.77) 27.27,31.58 31.84,31.58 32.61,30.81 34.74,30.81 34.85,30.92 35.58,30.92 35.66,31 U1.55
  Bottom Layer w0.104: v1(27.08,31.77) 27.08,31.77 26.87,31.57 26.56,31.57 26.24,31.24 26.24,5.58 P1.B11
P1_SS_RXB: length 36.7
  Top Layer w0.104: U1.56 35.66,30.6 35.58,30.68 34.95,30.68 34.84,30.57 32.51,30.57 31.74,31.34 31.43,31.34 31.36,31.27 31.36,31.21 31.28,31.14 30.92,31.14 30.85,31.21 30.85,31.27 30.77,31.34 30.41,31.34 30.34,31.27 30.34,31.21 30.27,31.14 29.9,31.14 29.83,31.21 29.83,31.27 29.76,31.34 27.29,31.34 27.07,31.12 v1(27.07,31.12)
  Bottom Layer w0.104: v1(27.07,31.12) 26.86,31.32 26.66,31.32 26.48,31.14 26.48,5.58 P1.B10
P1_SS_TXA: length 31
  Top Layer w0.104: v1(25.54,30.82) 25.75,30.62 31.43,30.62 32,30.05 34.74,30.05 35.06,29.72 35.58,29.72 35.66,29.8 U1.58
  Bottom Layer w0.104: v1(25.54,30.82) 25.34,30.62 25.05,30.62 24.76,30.33 24.76,11.91 C20.1
P1_SS_TXB: length 31.1
  Top Layer w0.104: U1.59 35.66,29.4 35.58,29.48 34.96,29.48 34.64,29.8 31.9,29.8 31.33,30.37 30.72,30.37 30.65,30.3 30.65,30.24 30.58,30.17 30.22,30.17 30.14,30.24 30.14,30.3 30.07,30.37 29.71,30.37 29.63,30.3 29.63,30.24 29.56,30.17 29.2,30.17 29.13,30.24 29.13,30.3 29.05,30.37 25.75,30.37 v1(25.54,30.17)
  Bottom Layer w0.104: v1(25.54,30.17) 25.34,30.37 25.15,30.37 25,30.23 25,11.91 C21.1
P1C_SS_RXA: length 29.5
  Top Layer w0.104: v1(33.06,31.27) 33.09,31.3 33.09,31.31 33.26,31.48 33.56,31.48 33.63,31.4 33.63,31.35 33.71,31.27 34.07,31.27 34.14,31.35 34.14,31.4 34.22,31.48 34.58,31.48 34.65,31.4 34.65,31.35 34.72,31.27 35.08,31.27 35.16,31.35 35.16,31.4 35.23,31.48 35.58,31.48 35.66,31.4 U1.54 ; P1.A11 30.61,8.05 30.48,8.18 30.48,8.62 v1(30.69,8.82)
  Bottom Layer w0.104: v1(30.69,8.82) 30.48,9.03 30.48,29.42 32.54,31.48 32.86,31.48 v1(33.06,31.27)
P1C_SS_RXB: length 29.4
  Top Layer w0.104: v1(30.03,8.82) 30.24,8.62 30.24,8.18 30.11,8.05 P1.A10 ; v1(33.06,31.93) 33.27,31.72 35.58,31.72 35.66,31.8 U1.53
  Bottom Layer w0.104: v1(33.06,31.93) 32.86,31.72 32.44,31.72 30.24,29.52 30.24,9.03 v1(30.03,8.82)
P1C_SS_TXA: length 27.1
  Top Layer w0.104: v1(35.26,32.94) 35.26,33.23 35.67,33.64 35.89,33.64 35.96,33.56 35.96,33.51 36.04,33.43 36.4,33.43 36.47,33.51 36.47,33.56 36.54,33.64 36.8,33.64 36.88,33.56 36.88,33.42 36.8,33.34 U1.51
  Bottom Layer w0.104: v1(35.26,32.94) 34.97,32.94 34.28,32.24 34.28,31.12 31.87,28.71 31.87,13.73 31.94,13.66 32,13.66 32.07,13.58 32.07,13.22 32,13.15 31.94,13.15 31.87,13.08 31.87,12.72 31.94,12.64 32,12.64 32.07,12.57 32.07,12.21 32,12.13 31.94,12.13 31.87,12.06 31.87,11.47 C27.2
P1C_SS_TXB: length 27.2
  Top Layer w0.104: v1(34.8,33.4) 35.09,33.4 35.57,33.88 36.91,33.88 37.12,33.66 37.12,33.42 37.2,33.34 U1.50
  Bottom Layer w0.104: v1(34.8,33.4) 34.8,33.11 34.04,32.34 34.04,31.23 31.62,28.81 31.62,11.47 C25.2
P2_CC1/HUB_CC: length 64.5
  Top Layer w0.152: P7.2 25.08,36.45 26.66,38.03 40.71,38.03 41.2,37.54 U1.40
  Top Layer w0.203: v2(2.67,7.87) 2.89,8.1 3.39,8.1
  Bottom Layer w0.203: v2(2.67,7.87) 3.68,8.89 6.6,8.89 12.19,14.48 12.19,18.54 17.78,24.13 17.78,33.4 18.67,34.29 21.97,34.29 P7.2
P2_CC2: length 62.9
  Top Layer w0.152: v1(25.37,37.42) 26.24,38.29 41.14,38.29 41.6,37.83 U1.39 ; v1(26.41,3.87) 27.73,3.87 P1.B5
  Bottom Layer w0.152: v1(25.37,37.42) 25.37,35.6 23.83,34.06 23.83,13.48 23.96,13.34 23.96,12.94 22.98,11.96 22.98,4.25 23.36,3.87 v1(26.41,3.87)
P2_HS_DM: length 32.6
  Top Layer w0.112: U1.26 44.35,29 44.43,28.92 67.78,28.92 69.71,26.98 69.71,23.42 69.18,22.88 68.43,22.88 68.35,22.8 P2.2
P2_HS_DP: length 32.7
  Top Layer w0.112: U1.25 44.35,28.6 44.43,28.68 44.98,28.68 45.06,28.6 45.06,28.56 45.13,28.48 45.48,28.48 45.56,28.56 45.56,28.6 45.64,28.68 45.99,28.68 46.07,28.6 46.07,28.56 46.15,28.48 46.5,28.48 46.58,28.56 46.58,28.6 46.66,28.68 47.01,28.68 47.09,28.6 47.09,28.56 47.17,28.48 47.52,28.48 47.6,28.56 47.6,28.6 47.67,28.68 48.02,28.68 48.1,28.6 48.1,28.56 48.18,28.48 48.53,28.48 48.61,28.56 48.61,28.6 48.69,28.68 67.68,28.68 69.47,26.89 69.47,23.52 69.08,23.12 68.43,23.12 68.35,23.2 P2.3
P2_SS_RXA: length 23.8
  Top Layer w0.104: U1.19 44.34,26.2 44.42,26.12 66.78,26.12 66.85,26.2 P2.5
P2_SS_RXB: length 23.8
  Top Layer w0.104: P2.6 66.85,25.8 66.78,25.88 44.42,25.88 44.34,25.8 U1.18
P2_SS_TXA: length 20.9
  Top Layer w0.104: U1.16 42.8,24.66 42.72,24.58 42.72,24.44 42.88,24.28 43.9,24.28 44.57,24.95 45.21,24.95 45.29,25.03 45.29,25.08 45.36,25.16 45.72,25.16 45.79,25.08 45.79,25.03 45.87,24.95 61.25,24.95 61.63,24.58 C26.2
P2_SS_TXB: length 20.9
  Top Layer w0.104: U1.15 42.4,24.66 42.48,24.58 42.48,24.34 42.78,24.04 44,24.04 44.67,24.71 61.15,24.71 61.45,24.4 C28.2
P3_HS_DM: length 38.5
  Top Layer w0.112: P3.2 62.4,11.8 62.48,11.72 62.48,10.99 62.22,10.73 58.62,10.73 57.51,11.84 57.51,14.44 58.54,15.47 58.54,20.96 57.74,21.76 49.56,21.76 49.48,21.84 49.48,21.88 49.4,21.96 49.05,21.96 48.97,21.88 48.97,21.84 48.89,21.76 48.55,21.76 48.47,21.84 48.47,21.88 48.39,21.96 48.04,21.96 47.96,21.88 47.96,21.84 47.88,21.76 47.53,21.76 47.45,21.84 47.45,21.88 47.37,21.96 47.02,21.96 46.94,21.88 46.94,21.84 46.86,21.76 46.52,21.76 46.25,22.03 41.65,22.03 39.92,23.76 39.92,24.57 40,24.65 U1.9
P3_HS_DP: length 38.7
  Top Layer w0.112: U1.8 39.6,24.65 39.68,24.57 39.68,23.66 41.55,21.79 46.16,21.79 46.42,21.52 57.63,21.52 58.3,20.85 58.3,15.57 57.27,14.54 57.27,11.74 58.52,10.49 62.32,10.49 62.72,10.89 62.72,11.72 62.8,11.8 P3.3
P3_SS_RXA: length 32.9
  Top Layer w0.104: U1.14 42,24.78 41.92,24.7 41.92,24.24 42.55,23.62 44.45,23.62 44.83,24 59.36,24 65.72,17.64 65.72,13.37 65.8,13.3 P3.5
P3_SS_RXB: length 32.9
  Top Layer w0.104: U1.13 41.6,24.8 41.68,24.72 41.68,24.14 42.44,23.38 44.55,23.38 44.93,23.76 59.26,23.76 65.48,17.54 65.48,13.37 65.4,13.3 P3.6
P3_SS_TXA: length 24.8
  Top Layer w0.104: U1.11 40.8,24.66 40.72,24.58 40.72,24.14 42,22.86 58.6,22.86 61.33,20.13 61.33,19.09 C41.2
P3_SS_TXB: length 24.8
  Top Layer w0.104: C43.2 61.08,19.09 61.08,20.03 58.5,22.62 41.9,22.62 40.48,24.03 40.48,24.58 40.4,24.66 U1.10
P4_HS_DM: length 27.2
  Top Layer w0.112: P4.2 44.2,11.8 44.28,11.72 44.28,10.93 44.72,10.49 48.48,10.49 49.76,11.77 49.76,15.39 43.94,21.21 41.33,21.21 39.12,23.42 39.12,24.57 39.2,24.65 U1.7
P4_HS_DP: length 27.1
  Top Layer w0.112: U1.6 38.8,24.65 38.88,24.57 38.88,23.32 41.23,20.97 43.84,20.97 44.07,20.75 44.07,20.63 44.04,20.6 44.04,20.49 44.28,20.24 44.39,20.24 44.43,20.27 44.54,20.27 44.79,20.03 44.79,19.92 44.75,19.88 44.75,19.77 45,19.52 45.11,19.52 45.14,19.56 45.26,19.56 45.5,19.31 45.5,19.2 45.47,19.16 45.47,19.05 45.72,18.81 45.83,18.81 45.86,18.84 45.98,18.84 49.52,15.29 49.52,11.87 48.38,10.73 44.82,10.73 44.52,11.03 44.52,11.72 44.6,11.8 P4.3
P4_SS_RXA: length 17.9
  Top Layer w0.104: U1.5 38.4,24.66 38.32,24.58 38.32,22.94 40.95,20.32 43.31,20.32 47.52,16.1 47.52,13.37 47.6,13.3 P4.5
P4_SS_RXB: length 17.9
  Top Layer w0.104: P4.6 47.2,13.3 47.28,13.37 47.28,16 43.21,20.08 40.84,20.08 38.08,22.84 38.08,24.58 38,24.66 U1.4
P4_SS_TXA: length 11.4
  Top Layer w0.104: C42.2 43.42,18.01 43.42,18.56 42.62,19.35 40.64,19.35 37.12,22.87 37.12,24.58 37.2,24.66 U1.2
P4_SS_TXB: length 11.4
  Top Layer w0.104: C44.2 43.17,18.01 43.17,18.46 42.52,19.11 40.54,19.11 36.88,22.77 36.88,24.58 36.8,24.66 U1.1
PWREN1#: length 27.2
  Top Layer w0.152: U1.28 46.34,29.8 v1(46.48,29.93)
  Top Layer w0.203: 34.6,13.53 v1(35.17,13.53)
  Bottom Layer w0.203: v1(35.17,13.53) 37.07,15.43 42.03,15.43 46.48,19.88 v1(46.48,29.93)
PWREN2#: length 26.8
  Top Layer w0.152: U1.30 44.37,30.6 44.44,30.67 47.49,30.67 47.79,30.37 49.35,30.37 49.65,30.67 58.03,30.67 63.49,36.13 67.4,36.13 67.55,35.98 67.55,35.43 U4.4
PWREN3#: length 16.5
  Top Layer w0.152: v1(48.01,31.37) 47.98,31.4 U1.32
  Top Layer w0.203: U6.4 v1(49.9,20.32)
  Bottom Layer w0.203: v1(48.01,31.37) 48.01,22.22 v1(49.9,20.32)
PWREN4#: length 26.5
  Top Layer w0.152: U1.34 45.26,32.2 v1(45.34,32.28)
  Top Layer w0.203: U7.4 32.38,20.82 32.51,20.95 35.69,20.95
  Bottom Layer w0.203: v1(35.56,20.95) 36.63,20.95 37.45,21.78 43.49,21.78 45.34,23.62 v1(45.34,32.28)
RESET#: length 3.7
  Top Layer w0.203: 38.35,35.14 38.8,34.69 U1.46
  Top Layer w0.254: 38.35,35.14 38.24,35.25 37.08,35.25
SMBCLK/SCL/EXCH#: length 63.3
  Top Layer w0.152: P8.1 20.64,34.22 27.17,34.22 28.48,35.53 28.48,36.9 28.78,37.21 38.87,37.21 39.2,36.87 U1.45
  Top Layer w0.203: v2(3.94,10.16) 4.05,10.05 U3.4
  Bottom Layer w0.203: P8.1 16.51,34.55 16.51,24.38 11.18,19.05 11.18,14.73 6.1,9.66 4.44,9.66 v2(3.94,10.16)
SMBDAT/SDA: length 61.1
  Top Layer w0.152: P8.2 17.96,38.54 37.38,38.54 v1(37.6,38.77)
  Top Layer w0.203: v2(4.95,10.16) 4.84,10.05 4.84,9.05 ; U1.49 v1(37.6,33.66)
  Bottom Layer w0.152: v1(37.6,33.66) v1(37.6,38.77)
  Bottom Layer w0.203: P8.2 15.87,24.51 10.67,19.3 10.67,14.86 5.97,10.16 v2(4.95,10.16)
SUSP/PDHUB#: length 2.6
  Top Layer w0.152: U1.44 39.6,33.42 39.52,33.5 39.52,34.78 R11.1
UP_HS_DM: length 32.7
  Top Layer w0.112: P5.14 10.04,22.02 10.59,22.58 11.02,22.58 11.81,23.37 11.81,26.42 14.84,29.45 30.74,29.45 32.31,27.88 35.57,27.88 35.65,27.8 U1.63
UP_HS_DP: length 32.7
  Top Layer w0.112: U1.62 35.65,28.2 35.57,28.12 32.41,28.12 30.84,29.69 14.75,29.69 11.57,26.52 11.57,23.47 10.92,22.82 10.59,22.82 10.04,23.38 P5.15
UP_SS_RXA: length 30.8
  Top Layer w0.104: U1.68 35.66,25.8 35.58,25.88 31.56,25.88 30.02,27.42 17,27.42 13.35,23.77 v1(13.35,23.48)
  Bottom Layer w0.104: v1(13.35,23.48) 13.06,23.48 10.81,21.23 10.58,21.23 10.03,20.67 P5.5
UP_SS_RXB: length 30.8
  Top Layer w0.104: U1.67 35.66,26.2 35.58,26.12 31.66,26.12 30.12,27.66 16.9,27.66 13.18,23.94 v1(12.89,23.94)
  Bottom Layer w0.104: P5.6 10.03,22.02 10.58,21.47 10.71,21.47 12.89,23.65 v1(12.89,23.94)
UP_SS_TXA: length 24.6
  Top Layer w0.104: U1.65 35.66,27 35.58,27.08 31.73,27.08 30.38,28.43 30.07,28.43 30,28.36 30,28.3 29.92,28.23 29.56,28.23 29.49,28.3 29.49,28.36 29.41,28.43 15.73,28.43 14.43,27.13 v1(14.43,26.84)
  Bottom Layer w0.104: 13.82,25.93 13.82,26.52 14.14,26.84 v1(14.43,26.84)
UP_SS_TXB: length 24.6
  Top Layer w0.104: v1(13.97,27.3) 14.26,27.3 15.63,28.68 30.48,28.68 31.83,27.32 35.58,27.32 35.66,27.4 U1.64
  Bottom Layer w0.104: 13.06,26.7 13.65,26.7 13.97,27.02 v1(13.97,27.3)
VSW: length 2.9
  Top Layer w0.203: L1.1 42.4,35.5 U1.37
XI: length 8
  Top Layer w0.152: C1.1 33.83,33.69 34.43,34.29 37.82,34.29 38.15,33.96 38.15,33.41 38,33.26 U1.48
  Top Layer w0.203: C1.1 32.21,33.69 X1.1
XO: length 11.2
  Top Layer w0.152: U1.47 38.4,34.07 37.92,34.54 34.29,34.54 33.78,35.05 C2.2
  Top Layer w0.203: X1.3 30.13,34.63 30.35,34.42 33.05,34.42 C2.2
$1N60: length 4.6
  Top Layer w0.104: P1.A3 26.61,8.05 26.48,8.18 26.48,8.49 26.04,8.94 25.24,8.94 25,9.17 25,9.58 25.14,9.71 v1(25.39,9.71)
  Bottom Layer w0.104: C21.2 v1(25.39,9.71)
$1N61: length 4.6
  Top Layer w0.104: P1.A2 26.11,8.05 26.24,8.18 26.24,8.39 25.93,8.7 25.14,8.7 24.76,9.07 24.76,9.58 24.63,9.71 v1(24.37,9.71)
  Bottom Layer w0.104: C20.2 v1(24.37,9.71)
$1N64: length 5.5
  Bottom Layer w0.104: C27.1 31.87,9.61 31.87,7.81 30.48,6.42 30.48,5.58 P1.B2
$1N65: length 5.5
  Bottom Layer w0.104: C25.1 31.62,9.61 31.62,7.91 30.24,6.52 30.24,5.58 P1.B3
$1N89: length 1.9
  Top Layer w0.203: U4.5 67.5,34.43 R14.1
$1N95: length 1.7
  Top Layer w0.203: U5.5 33.64,15.12 R15.1
$1N101: length 3.1
  Top Layer w0.203: U7.5 33.02,17.78 33.22,17.98 R17.1
$1N107: length 1.5
  Top Layer w0.203: R16.1 48.44,18.8 U6.5
$1N150: length 4
  Top Layer w0.203: P5.10 9.89,16.62 10.67,17.4 R3.1
$1N151: length 4.9
  Bottom Layer w0.112: 13.05,25.16 12.46,25.16 11.23,23.93 10.59,23.93 10.04,23.38 P5.7
$1N152: length 4.9
  Bottom Layer w0.112: P5.8 10.04,24.72 10.59,24.17 11.13,24.17 11.56,24.6 11.56,24.71 11.53,24.74 11.53,24.86 11.77,25.1 11.89,25.1 11.92,25.07 12.03,25.07 12.29,25.33 12.29,25.93
$1N160: length 3.6
  Top Layer w0.203: R9.2 22.05,14.73 R8.1 21.85,16.45 20.12,16.45
$1N163: length 11.7
  Top Layer w0.254: 18.92,19.21 18.96,19.18 22.99,19.18 23.15,19.01 C10.1
  Top Layer w0.508: 18.42,17.4 U2.2
  Top Layer w0.762: 18.42,17.4 18.49,17.4 18.92,17.84 18.92,20.62 17.41,22.14 L2.1
$1N165: length 1.9
  Top Layer w0.203: 20.12,17.4 22.06,17.4
$1N186: length 1.7
  Top Layer w0.203: C19.1 7.19,8.5 U3.16
$1N1769: length 6
  Top Layer w0.112: C41.1 61.33,17.23 61.33,15.93 59.72,14.32 59.72,13.38 59.8,13.3 P3.8
$1N1770: length 6
  Top Layer w0.112: P3.9 59.4,13.3 59.48,13.38 59.48,14.42 61.09,16.03 61.09,17.23 C43.1
$1N1773: length 5
  Top Layer w0.112: C42.1 43.42,16.15 43.42,15.72 41.52,13.82 41.52,13.38 41.6,13.3 P4.8
$1N1774: length 5
  Top Layer w0.112: P4.9 41.2,13.3 41.28,13.38 41.28,13.92 43.18,15.82 43.18,16.15 C44.1
$1N1801: length 2
  Top Layer w0.381: R10.1 LED1.1
$1N1802: length 2
  Top Layer w0.203: 20.12,18.35 21.87,18.35 22.06,18.54
$1N1819: length 6.8
  Top Layer w0.112: P2.8 66.85,20.2 66.77,20.12 66.08,20.12 64.1,22.1 64.1,22.21 64.13,22.25 64.13,22.36 63.88,22.6 63.77,22.6 63.74,22.57 63.63,22.57 62.99,23.21 C26.1
$1N1820: length 6.8
  Top Layer w0.112: C28.1 62.82,23.04 65.98,19.88 66.77,19.88 66.85,19.8 P2.9

## Copper pours and planes (outline as drawn; the poured copper is in the pictures)
DVDD12 on Top Layer: 48.26,37.08 48.39,36.96 48.39,34.5 48.23,34.34 44.7,34.34 44.7,37.08
DVDD12 on Layer 2: 47.24,23.24 47.63,23.62 47.63,36.64 47.35,36.92 39.85,36.92 38.87,35.94 35.18,35.94 34.8,35.56 34.8,25.65 37.21,23.24
GND on Top Layer: 0,40 80,40 80,0.01 80.01,0 0.13,0 0,0.13 0,13.25 7.5,13.25 7.5,26.75 0.08,26.75 0,26.67
GND on Bottom Layer: 0,40 80,40 80,0.01 80.01,0 0.13,0 0,0.13 0,13.25 7.5,13.25 7.5,26.75 0.08,26.75 0,26.67
GND on Layer 1: 0,40 80,40 80,0.01 80.01,0 0.13,0 0,0.13 0,13.25 7.5,13.25 7.5,26.75 0.08,26.75 0,26.67
GND on Layer 2: 0,40 80,40 80,0.01 80.01,0 0.13,0 0,0.13 0,13.25 7.5,13.25 7.5,26.75 0.08,26.75 0,26.67
VBUS on Top Layer: 10.79,16.63 9.91,15.75 8.13,15.75 7.87,15.49 7.87,14.35 8.25,13.97 8.25,12.83 7.87,12.45 7.87,9.4 8,9.27 9.14,9.27 10.8,10.92 11.8,10.92 11.8,13.33 12.95,14.47 12.95,16.49 12.8,16.63
VBUS_OUT1 on Top Layer: 29.15,12.13 32.81,12.13 32.96,11.97 32.96,10.55 32.73,10.32 29.39,10.32 29.15,10.55
VBUS_OUT1 on Layer 2: 29.58,12.13 29.71,12 29.71,8.44 29.96,8.19 29.96,5.78 29.83,5.65 26.91,5.65 26.79,5.78 26.79,11.87 27.04,12.13
VBUS_OUT2 on Top Layer: 71.45,33.8 71.91,34.26 73.99,34.26 74.29,33.97 74.29,32.57 73.9,32.19 69.46,32.19 69.33,32.32 69.33,33.72 69.42,33.8
VBUS_OUT3 on Top Layer: 51.86,18.11 53.27,18.11 54.12,17.26 54.12,16.45 52.52,16.45 51.68,17.28 51.68,18.1 51.68,18.11 51.86,18.11
VBUS_OUT4 on Top Layer: 39.55,17.09 39.69,16.95 39.69,16.13 39.75,16.08 39.49,15.82 35,15.82 34.4,16.42 34.4,17.09 34.4,17.09
VDD5 on Top Layer: 50.42,18.16 50.42,16.89 50.29,16.76 49.4,16.76 48.64,17.53 48.64,18.03 48.77,18.16
VDD5 on Top Layer: 66.29,33.78 66.17,33.66 66.17,32.38 66.29,32.26 67.95,32.26 68.07,32.38 68.07,33.78 68.07,33.78
VDD5 on Top Layer: 22.48,25.02 22.1,24.64 22.1,20.45 22.61,19.94 29.33,19.94 29.58,19.68 29.58,13.23 29.84,12.97 32.91,12.97 32.91,17.02 31.75,17.02 31.5,17.27 31.5,21.08 31.88,21.46 35.56,21.46 35.81,21.72 35.81,24.64 35.43,25.02
VDD5 on Layer 2: 34.95,24.87 36.96,22.86 49.4,22.86 49.78,23.24 49.78,33.53 50.17,33.91 75.57,33.91 75.82,33.66 75.82,3.57 73.74,1.49 14.13,1.49 13.08,2.54 13.08,16.26 17.4,20.57 17.4,29.21 16.64,29.97 7.62,29.97 7.37,30.23 7.37,34.29 7.75,34.67 22.73,34.67 23.24,34.16 23.24,6.98 26.67,3.56 33.15,3.56 34.04,4.44 34.04,24.64 34.27,24.87
VIN on Top Layer: 14.86,8 14.99,8.13 14.99,8.76 15.37,9.14 18.54,9.14 18.8,9.4 18.8,11.95 19.7,11.95 19.94,12.19 19.94,12.83 19.68,13.08 19.68,14.99 21.08,14.99 21.21,14.86 21.21,6.98 20.95,6.73 17.14,6.73 17.02,6.6 17.02,5.25 16.49,5.25 16.49,6.63 16.38,6.73 12.32,6.73 12.19,6.6 12.19,5.28 11.72,5.28 11.72,7.91 11.81,8
VHV on Top Layer: 12.62,9.99 12.45,10.16 12.45,13.33 14.48,15.37 14.48,17.27 14.61,17.4 16.26,17.4 16.89,16.76 18.16,16.76 18.16,10.03 18.12,9.99

## Text on the board
Top Silkscreen Layer: GND | SDA | SCL | PWR | CC1 | 5V | 3.3V
